# Altium schematic sheet Power.SchDoc
size A4; SheetNumber: 3; SheetTotal: 5
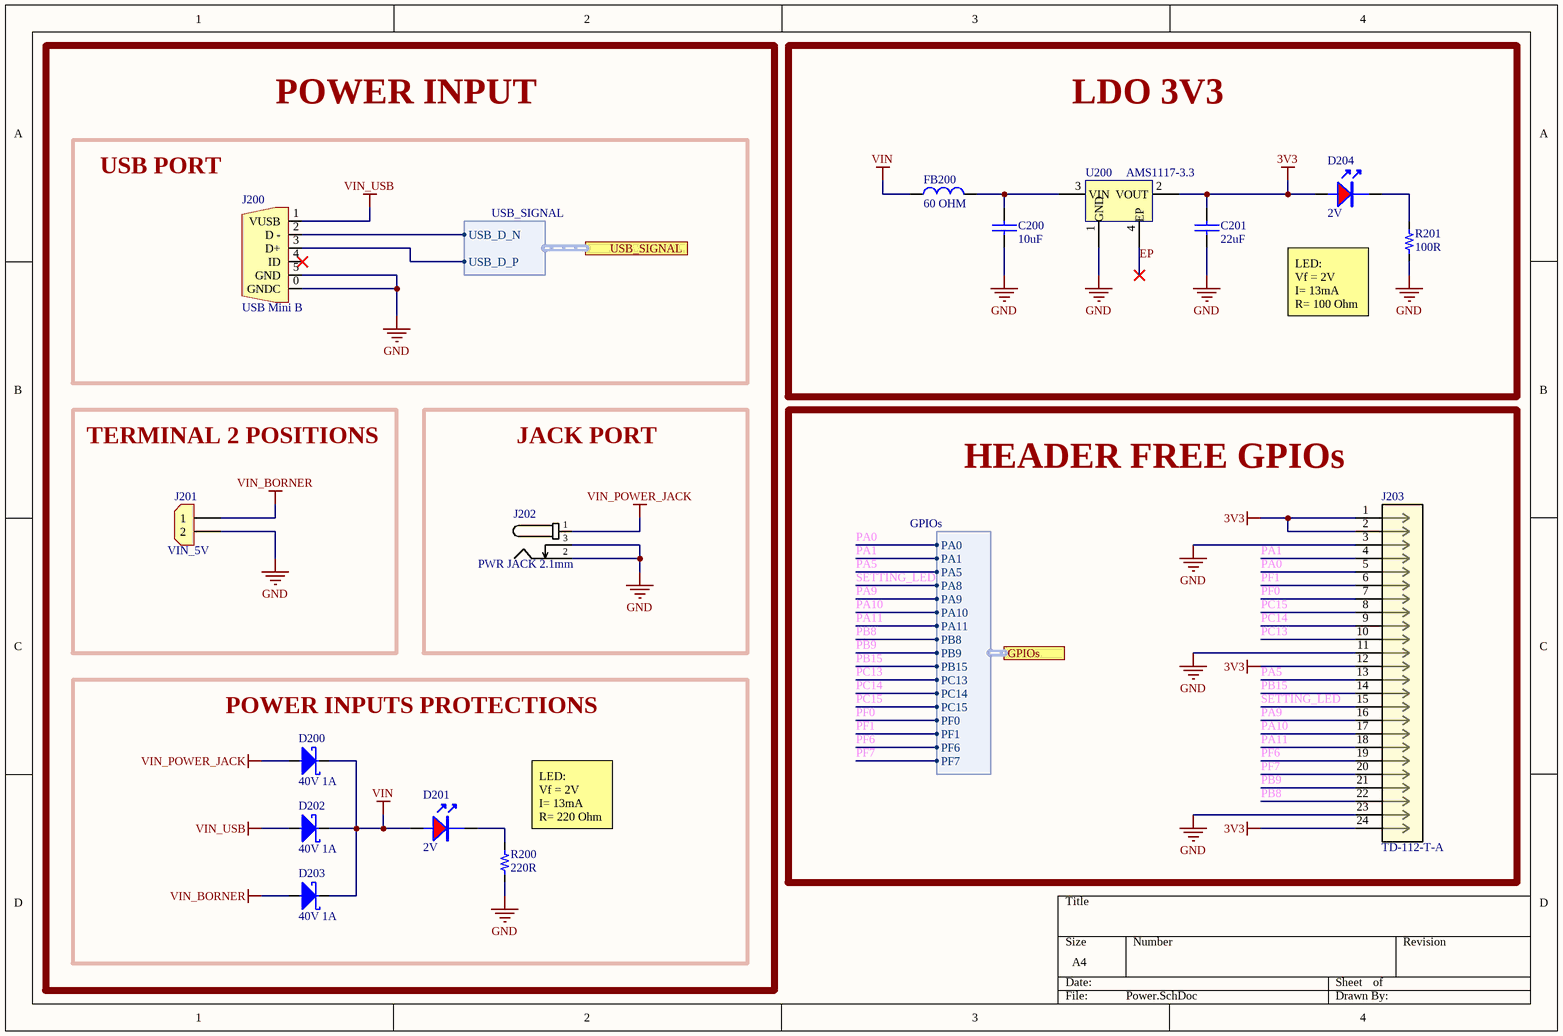
[diagram p0: Power.SchDoc]

## Parts
C200  value 10uF  [0603_cap]  (hidden comment: 10uF 10V)
C201  value 22uF  [0603_cap]  (hidden comment: 22uF 6V3)
D200  40V 1A  [SOD_123]
D201  2V  [0805_LED]
D202  40V 1A  [SOD_123]
D203  40V 1A  [SOD_123]
D204  2V  [0805_LED]
FB200  value 60 OHM  [0603_fb]  (hidden comment: 60OHM 2A)
J200  USB Mini B  [CON_5x1_SMD_miniUSB_B]
J201  VIN_5V  [CON_2x1_TH_5MM]
J202  PWR JACK 2.1mm  [CON_POWER_BARREL_2.1MM_3CONN]
J203  TD-112-T-A  [CON_12X2_TH_2.54mm]
R200  value 220R  [0603_res]  (hidden comment: 220R 1/10W)
R201  value 100R  [0603_res]  (hidden comment: 100R 1/10W)
U200  AMS1117-3.3  [SOT_223]

## Blocks framed on the sheet
LDO 3V3: C200 C201 D204 FB200 R201 U200
USB PORT: J200
TERMINAL 2 POSITIONS: J201
JACK PORT: J202
HEADER FREE GPIOs: J203
POWER INPUTS PROTECTIONS: D200-D203 R200

## Ports
GPIOs (harness GPIOs, see main[3B], MCU[3C]), USB_SIGNAL (harness USB_SIGNAL, see main[3B], Communication[1B])

## Harnesses
USB_SIGNAL: USB_D_N, USB_D_P
GPIOs: PA0, PA1, PA5, PA8, PA9, PA10, PA11, PB8, PB9, PB15, PC13, PC14, PC15, PF0, PF1, PF6, PF7

## Nets
3V3: C201.1 D204.1(A) J203.1 J203.2 J203.12 J203.24 U200.2(VOUT)
GND: C200.2 C201.2 J200.0(GNDC) J200.5(GND) J201.2 J202.2 J202.3 J203.3 J203.11 J203.23 R200.1 R201.1 U200.1(GND)
VIN: D200.1 D201.1(A) D202.1 D203.1 FB200.1
VIN_BORNER: D203.2 J201.1
VIN_POWER_JACK: D200.2 J202.1
VIN_USB: D202.2 J200.1(VUSB)
EP: U200.4(EP)
PA0: J203.5 ; port GPIOs.PA0
PA1: J203.4 ; port GPIOs.PA1
PA5: J203.13 ; port GPIOs.PA5
PA9: J203.16 ; port GPIOs.PA9
PA10: J203.17 ; port GPIOs.PA10
PA11: J203.18 ; port GPIOs.PA11
PB8: J203.22 ; port GPIOs.PB8
PB9: J203.21 ; port GPIOs.PB9
PB15: J203.14 ; port GPIOs.PB15
PC13: J203.10 ; port GPIOs.PC13
PC14: J203.9 ; port GPIOs.PC14
PC15: J203.8 ; port GPIOs.PC15
PF0: J203.7 ; port GPIOs.PF0
PF1: J203.6 ; port GPIOs.PF1
PF6: J203.19 ; port GPIOs.PF6
PF7: J203.20 ; port GPIOs.PF7
SETTING_LED: J203.15 ; port GPIOs.PA8
NetC200_1: C200.1 FB200.2 U200.3(VIN)
NetD201_2: D201.2 R200.2
NetD204_2: D204.2 R201.2
NetJ200_2: J200.2(D_-) ; port USB_SIGNAL.USB_D_N
NetJ200_3: J200.3(D+) ; port USB_SIGNAL.USB_D_P

Not connected (* = marked no-connect by the designer): J200 4(ID)*

## Notes on the sheet
- POWER INPUT
- LED:
  Vf = 2V
  I= 13mA
  R= 100 Ohm
- (near R200) LED:
  Vf = 2V
  I= 13mA
  R= 220 Ohm

## Library data of the parts
C200 = Cap_10uF_0603_10V: 10V 10uF X5R ±10% 0603 Multilayer Ceramic Capacitors MLCC - SMD/SMT ROHS; Manufacturer: CCTC; Manufacturer Part Number: TCC0603X5R106K100CT; Supplier 1: LCSC; Supplier Part Number 1: C380314; ComponentLink1Description: LCSC; ComponentLink1URL: https://www.lcsc.com/product-detail/Multilayer-Ceramic-Capacitors-MLCC-SMD-SMT_CCTC-TCC0603X5R106K100CT_C380314.html
C201 = Cap_22uF_0805_6V3: 6.3V 22uF X5R ±20% 0805 Multilayer Ceramic Capacitors MLCC - SMD/SMT ROHS; Manufacturer: Samsung Electro-Mechanics; Manufacturer Part Number: CL21A226MQQNNNE; Supplier 1: LCSC; Supplier Part Number 1: C5674; ComponentLink1Description: LCSC; ComponentLink1URL: https://www.lcsc.com/product-detail/Multilayer-Ceramic-Capacitors-MLCC-SMD-SMT_Samsung-Electro-Mechanics-CL21A226MQQNNNE_C5674.html
D200 D202 D203 = D_Schottky_40V_1A_SOD_123F: DIODE SCHOTTKY 40V 1A SOD123F; Manufacturer: Shanghai Prisemi Elec; Manufacturer Part Number: PSBD1DF40V1H; Supplier 1: LCSC; Supplier Part Number 1: C110730; ComponentLink1Description: LCSC; ComponentLink1URL: https://www.lcsc.com/product-detail/Switching-Diode_Shanghai-Prisemi-Elec-PSBD1DF40V1H_C110730.html
D201 D204 = LED_0805_RED: LED RED CLEAR 0805 SMD; Manufacturer: XINGLIGHT; Manufacturer Part Number: XL-2012SURC; Supplier 1: LCSC; Supplier Part Number 1: C965812; ComponentLink1Description: LCSC; ComponentLink1URL: https://www.lcsc.com/product-detail/Light-Emitting-Diodes-LED_XINGLIGHT-XL-2012SURC_C965812.html
FB200 = FB_60_0603_2A: 2A 1 100mΩ 60Ω@100MHz ±25% 0603 Ferrite Beads ROHS; Manufacturer: TAI-TECH; Manufacturer Part Number: HCB1608KF-600T20; ComponentLink1Description: LCSC; ComponentLink1URL: https://www.lcsc.com/product-detail/Ferrite-Beads_TAI-TECH-HCB1608KF-600T20_C369516.html; Supplier 1: LCSC; Supplier Part Number 1: C369516
J200 = Con_Mini_USB_B: CONN RCPT USB2.0 MINI B SMD R/A; Manufacturer Part Number: KH-MINI-SMT-5P-Cu; Manufacturer: EDAC Inc.; ComponentLink1Description: LCSC; ComponentLink1URL: https://datasheet.lcsc.com/lcsc/2106070035_Shenzhen-Kinghelm-Elec-KH-MINI-SMT-5P-Cu_C2688795.pdf; Supplier 1: LCSC; Supplier Part Number 1: C2688795
J201 = Con_2x1_TH_5mm: 2POS 5MM; Manufacturer: JILN; Manufacturer Part Number: JL126-50002G01; Supplier 1: LCSC; Supplier Part Number 1: C394556; ComponentLink1Description: Digi-Key; ComponentLink1URL: https://www.lcsc.com/product-detail/Screw-terminal_JILN-JL126-50002G01_C394556.html
J202 = Con_Power_Jack_2.1mm_3pins: CONN PWR JACK 2X5.5MM SOLDER; Manufacturer: HCTL; Manufacturer Part Number: HC-DC-005-2.0T; Supplier 1: LCSC; Supplier Part Number 1: C3010533; ComponentLink1Description: LCSC; ComponentLink1URL: https://www.lcsc.com/product-detail/AC-DC-Power-Connectors_HCTL-HC-DC-005-2-0T_C3010533.html
J203 = Con_12X2_TH_2.54mm: CONN HEADER VERT 24POS 2.54MM; Manufacturer: Samtec Inc.; Manufacturer Part Number: TD-112-T-A; Supplier 1: DigiKey; Supplier Part Number 1: SAM1114-12-ND; ComponentLink1Description: Digi-Key; ComponentLink1URL: https://www.digikey.com/en/products/detail/samtec-inc/TD-112-T-A/1105546
R200 = Res_220R_0603_1/10W: RES SMD 220R OHM 5% 1/10W 0603; Manufacturer: FOJAN; Manufacturer Part Number: FRC0603J221 TS; ComponentLink1URL: https://www.lcsc.com/product-detail/Chip-Resistor-Surface-Mount_FOJAN-FRC0603J221-TS_C2907127.html; Supplier 1: LCSC; Supplier Part Number 1: C2907127; ComponentLink1Description: LCSC
R201 = Res_100R_0603_1/10W: RES SMD 100R OHM 5% 1/10W 0603; Manufacturer: FOJAN; Manufacturer Part Number: FRC0603J101 TS; ComponentLink1URL: https://www.lcsc.com/product-detail/Chip-Resistor-Surface-Mount_FOJAN-FRC0603J101-TS_C2907089.html; Supplier 1: LCSC; Supplier Part Number 1: C2907089; ComponentLink1Description: LCSC
U200 = LDO_3V3_1A_FIXED: 1A 60dB@(120Hz) Fixed 3.3V Positive 18V SOT-223 Linear Voltage Regulators (LDO) ROHS; Manufacturer: UMW(Youtai Semiconductor Co., Ltd.); ComponentLink1Description: LCSC; ComponentLink1URL: https://www.lcsc.com/product-detail/_UMW-Youtai-Semiconductor-Co-Ltd-_C347222.html; Supplier 1: LCSC; Manufacturer Part Number: AMS1117-3.3; Supplier Part Number 1: C347222